# Altium schematic sheet jtag.SchDoc
size A4
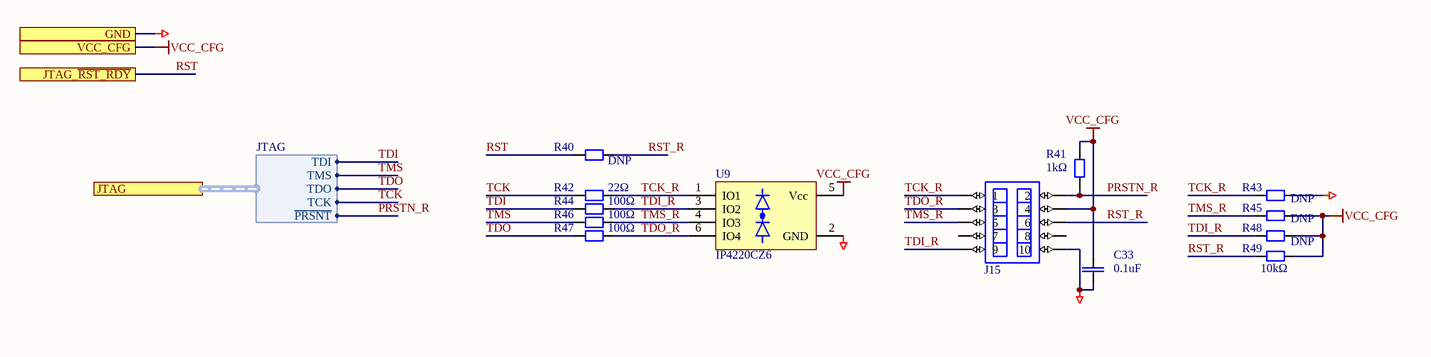
[diagram p0: jtag.SchDoc]

## Parts
C33  0.1uF  [CAPC2012N]
J15  IDC-10MC  [PLD-10]  (value not drawn)
R40  DNP  [RESC1608N]
R41  1kΩ  [RESC2012N]
R42  22Ω  [RESC1608N]
R43  DNP  [RESC2012N]
R44  100Ω  [RESC1608N]
R45  DNP  [RESC2012N]
R46  100Ω  [RESC1608N]
R47  100Ω  [RESC1608N]
R48  DNP  [RESC2012N]
R49  10kΩ  [RESC2012N]
U9  IP4220CZ6  [SOT95P285X110-6N]

## Ports
GND, JTAG (harness JTAG), JTAG_~{RST_RDY}, VCC_CFG

## Harnesses
JTAG: TDI, TMS, TDO, TCK, ~{PRSNT}

## Nets
GND: C33.1 J15.10 R43.2 U9.2(GND) ; port GND
VCC_CFG: C33.2 J15.4 R41.2 R45.2 R48.2 R49.2 U9.5(Vcc) ; port VCC_CFG
PRSTN_R: J15.2 R41.1 ; port JTAG.~{PRSNT}
RST: R40.1 ; port JTAG_~{RST_RDY}
RST_R: J15.6 R40.2 R49.1
TCK: R42.1 ; port JTAG.TCK
TCK_R: J15.1 R42.2 R43.1 U9.1(IO1)
TDI: R44.1 ; port JTAG.TDI
TDI_R: J15.9 R44.2 R48.1 U9.3(IO2)
TDO: R47.1 ; port JTAG.TDO
TDO_R: J15.3 R47.2 U9.6(IO4)
TMS: R46.1 ; port JTAG.TMS
TMS_R: J15.5 R45.1 R46.2 U9.4(IO3)

Not connected (* = marked no-connect by the designer): J15 7 8

## Library data of the parts
C33 = CAPC: Generic ceramic SMD capacitor; Pkg: 0805; Maintainer: Evgeniy Kotov; SMD Solders: 2; THD Solders: 0; PartField: 0.1uF; Last Change Data: 06.03.2017; Release Date: 06.03.2017; Value: 0.1uF
J15 = IDC-10MS: Connector, 5x2, Male, 2.54mm Pitch, Strait contacts, with Body; SMD Solders: 0; THD Solders: 10; Maintainer: Evgeniy Kotov; Pkg: IDC-10; PartField: IDC-10MC; Last Change Data: 28.03.2017; Release Date: 28.03.2017; Value: IDC-10MC; ComponentLink1Description: Datasheet
R40 = RESC: Resistor, Generic, SMD; PartField: 100Ω; Pkg: 0603; Maintainer: Evgeniy Kotov; SMD Solders: 2; THD Solders: 0; Release Date: 06.03.2017; Last Change Data: 09.03.2017; Value: DNP
R41 R49 = RESC: Resistor, Generic, SMD; Pkg: 0805; Maintainer: Evgeniy Kotov; SMD Solders: 2; THD Solders: 0; Release Date: 06.03.2017; Last Change Data: 09.03.2017
  R41: PartField: 1kΩ; Value: 1kΩ
  R49: PartField: 10kΩ; Value: 10kΩ
R42 R44 R46 R47 = RESC: Resistor, Generic, SMD; Pkg: 0603; Maintainer: Evgeniy Kotov; SMD Solders: 2; THD Solders: 0; Release Date: 06.03.2017; Last Change Data: 09.03.2017
  R42: PartField: 22Ω; Value: 22Ω
  R44 R46 R47: PartField: 100Ω; Value: 100Ω
R43 = RESC: Resistor, Generic, SMD; PartField: 1kΩ; Pkg: 0805; Maintainer: Evgeniy Kotov; SMD Solders: 2; THD Solders: 0; Release Date: 06.03.2017; Last Change Data: 09.03.2017; Value: DNP
R45 R48 = RESC: Resistor, Generic, SMD; PartField: 10kΩ; Pkg: 0805; Maintainer: Evgeniy Kotov; SMD Solders: 2; THD Solders: 0; Release Date: 06.03.2017; Last Change Data: 09.03.2017; Value: DNP
U9 = IP4220CZ6: Transimpedance Amplifier; Selectable-Feedback Resistance; Pkg: SOT457; SMD Solders: 6; THD Solders: 0; Maintainer: Evgeniy Kotov; Vendor: NXP; PartField: IP4220CZ6; ComponentLink1URL: http://assets.nexperia.com/documents/data-sheet/IP4220CZ6.pdf; ComponentLink1Description: Datasheet; Last Change Date: 28.03.2017; Release Date: 28.03.2017; Value: IP4220CZ6